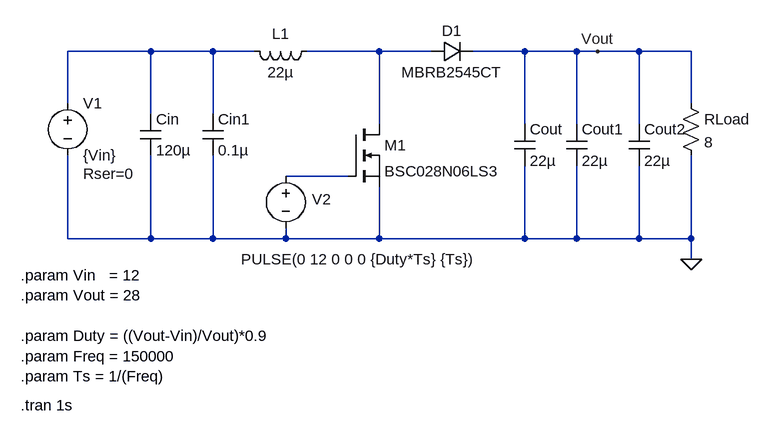
[diagram p0: schematic Boost Converter Open Model.asc]
Boost Converter Open Model.asc, the LTspice schematic file:
Version 4.1
SHEET 1 896 680
WIRE -32 80 -160 80
WIRE 64 80 -32 80
WIRE 128 80 64 80
WIRE 320 80 208 80
WIRE 400 80 320 80
WIRE 544 80 464 80
WIRE 624 80 544 80
WIRE 656 80 624 80
WIRE 720 80 656 80
WIRE 800 80 720 80
WIRE -160 160 -160 80
WIRE 800 160 800 80
WIRE -32 176 -32 80
WIRE 64 176 64 80
WIRE 320 192 320 80
WIRE 544 192 544 80
WIRE 624 192 624 80
WIRE 720 192 720 80
WIRE 272 272 176 272
WIRE -160 368 -160 240
WIRE -32 368 -32 240
WIRE -32 368 -160 368
WIRE 64 368 64 240
WIRE 64 368 -32 368
WIRE 176 368 176 352
WIRE 176 368 64 368
WIRE 320 368 320 288
WIRE 320 368 176 368
WIRE 544 368 544 256
WIRE 544 368 320 368
WIRE 624 368 624 256
WIRE 624 368 544 368
WIRE 720 368 720 256
WIRE 720 368 624 368
WIRE 800 368 800 240
WIRE 800 368 720 368
WIRE 800 400 800 368
FLAG 800 400 0
FLAG 656 80 Vout
SYMBOL ind 224 64 R90
WINDOW 0 4 56 VBottom 2
WINDOW 3 32 56 VTop 2
SYMATTR InstName L1
SYMATTR Value 22µ
SYMATTR SpiceLine Ipk=23 Rser=0.0251 Rpar=6432 Cpar=41.625p mfg="Bourns, Inc." pn="SRP1770TA-220M"
SYMBOL diode 400 96 R270
WINDOW 0 32 32 VTop 2
WINDOW 3 0 32 VBottom 2
SYMATTR InstName D1
SYMATTR Value MBRB2545CT
SYMBOL nmos 272 192 R0
SYMATTR InstName M1
SYMATTR Value BSC028N06LS3
SYMBOL voltage -160 144 R0
WINDOW 123 0 0 Left 0
WINDOW 39 24 124 Left 2
SYMATTR SpiceLine Rser=0
SYMATTR InstName V1
SYMATTR Value {Vin}
SYMBOL voltage 176 256 R0
WINDOW 0 40 51 Left 2
WINDOW 3 -69 144 Left 2
WINDOW 123 0 0 Left 0
WINDOW 39 0 0 Left 0
SYMATTR InstName V2
SYMATTR Value PULSE(0 12 0 0 0 {Duty*Ts} {Ts})
SYMBOL res 784 144 R0
SYMATTR InstName RLoad
SYMATTR Value 8
SYMBOL cap 528 192 R0
SYMATTR Value 22µ
SYMATTR InstName Cout
SYMATTR SpiceLine V=50 Irms=2.5 Rser=0.0192 Lser=4.557n mfg="Würth Elektronik" pn="870135774001 WCAP-PTHT 8 x 8" type="Al polymer"
SYMBOL cap -48 176 R0
SYMATTR Value 120µ
SYMATTR InstName Cin
SYMATTR SpiceLine V=50 Irms=220m Rser=0.2 Lser=22.6n mfg="Würth Elektronik" pn="860020674016 WCAP-ATG5 8x16" type="Al electrolytic"
SYMBOL cap 48 176 R0
SYMATTR InstName Cin1
SYMATTR Value 0.1µ
SYMATTR SpiceLine V=50 Irms=0 Rser=0.105 Lser=784p mfg="Würth Elektronik" pn="885382206004 WCAP-CSST 0603" type="X7R"
SYMBOL cap 608 192 R0
SYMATTR Value 22µ
SYMATTR InstName Cout1
SYMATTR SpiceLine V=50 Irms=2.5 Rser=0.0192 Lser=4.557n mfg="Würth Elektronik" pn="870135774001 WCAP-PTHT 8 x 8" type="Al polymer"
SYMBOL cap 704 192 R0
SYMATTR Value 22µ
SYMATTR InstName Cout2
SYMATTR SpiceLine V=50 Irms=2.5 Rser=0.0192 Lser=4.557n mfg="Würth Elektronik" pn="870135774001 WCAP-PTHT 8 x 8" type="Al polymer"
TEXT -232 424 Left 2 !.param Vin   = 12\n.param Vout = 28\n \n.param Duty = ((Vout-Vin)/Vout)*0.9\n.param Freq = 150000\n.param Ts = 1/(Freq)
TEXT -232 624 Left 2 !.tran 1s

The netlist it stands for:
* Boost Converter Open Model.asc
L1 N002 N001 22µ Ipk=23 Rser=0.0251 Rpar=6432 Cpar=41.625p mfg="Bourns, Inc." pn="SRP1770TA-220M"
D1 N002 Vout MBRB2545CT
M1 N002 N003 0 0 BSC028N06LS3
V1 N001 0 {Vin} Rser=0
V2 N003 0 PULSE(0 12 0 0 0 {Duty*Ts} {Ts})
RLoad Vout 0 8
Cout Vout 0 22µ V=50 Irms=2.5 Rser=0.0192 Lser=4.557n mfg="Würth Elektronik" pn="870135774001 WCAP-PTHT 8 x 8" type="Al polymer"
Cin N001 0 120µ V=50 Irms=220m Rser=0.2 Lser=22.6n mfg="Würth Elektronik" pn="860020674016 WCAP-ATG5 8x16" type="Al electrolytic"
Cin1 N001 0 0.1µ V=50 Irms=0 Rser=0.105 Lser=784p mfg="Würth Elektronik" pn="885382206004 WCAP-CSST 0603" type="X7R"
Cout1 Vout 0 22µ V=50 Irms=2.5 Rser=0.0192 Lser=4.557n mfg="Würth Elektronik" pn="870135774001 WCAP-PTHT 8 x 8" type="Al polymer"
Cout2 Vout 0 22µ V=50 Irms=2.5 Rser=0.0192 Lser=4.557n mfg="Würth Elektronik" pn="870135774001 WCAP-PTHT 8 x 8" type="Al polymer"
.model D D
.lib standard.dio
.model NMOS NMOS
.model PMOS PMOS
.lib standard.mos
.param Vin   = 12
.param Vout = 28
.param Duty = ((Vout-Vin)/Vout)*0.9
.param Freq = 150000
.param Ts = 1/(Freq)
.tran 1s
.backanno
.end